# EAGLE design avrLCD (EAGLE 6.1)
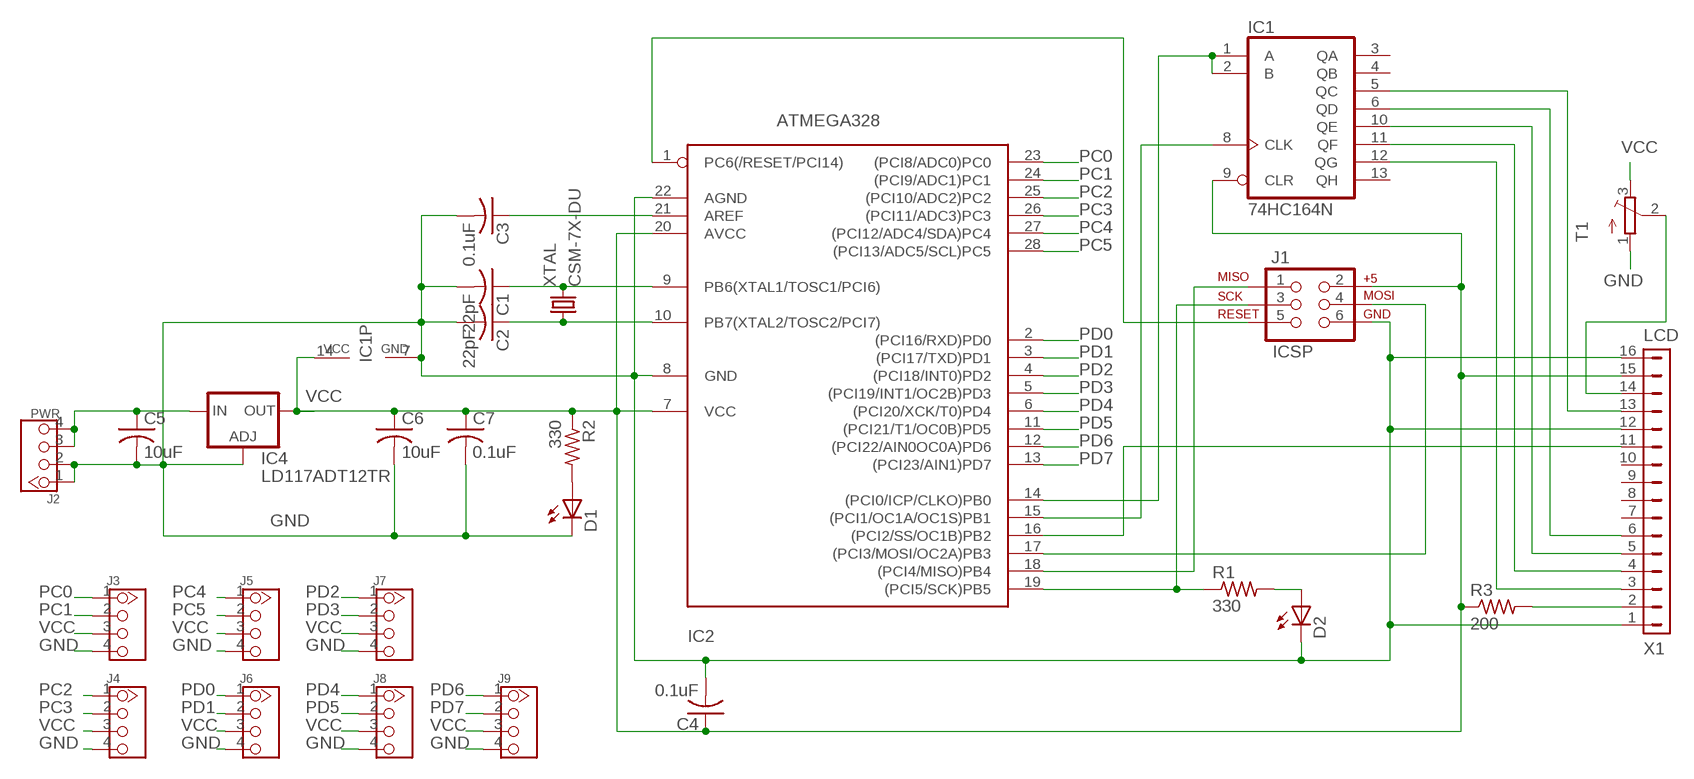
[diagram p0: schematic, sheet 1]

## Parts
C1  22pF  C-USC0805  [C0805]
C2  22pF  C-USC0805  [C0805]
C3  0.1uF  C-USC0805  [C0805]
C4  0.1uF  C-USC0805  [C0805]
C5  10uF  C-USC1206  [C1206]
C6  10uF  C-USC1206  [C1206]
C7  0.1uF  C-USC0805  [C0805]
D1  LEDCHIP-LED0805  [CHIP-LED0805]
D2  LEDCHIP-LED0805  [CHIP-LED0805]
IC1  74HC164N  [DIL14]
IC2  ATMEGA328  ATMEGA168-20P  [DIL28-3]
IC4  LD117ADT12TR  [DPACK]
J1  ICSP  AVR_SPI_PRG_6NS  [2X3-NS]
J2  PWR  TWIG-4P-2.0-2.0  [4P-2.0]
J3  TWIG-4P-2.0-2.0  [4P-2.0]
J4  TWIG-4P-2.0-2.0  [4P-2.0]
J5  TWIG-4P-2.0-2.0  [4P-2.0]
J6  TWIG-4P-2.0-2.0  [4P-2.0]
J7  TWIG-4P-2.0-2.0  [4P-2.0]
J8  TWIG-4P-2.0-2.0  [4P-2.0]
J9  TWIG-4P-2.0-2.0  [4P-2.0]
R1  330  R-US_R0805  [R0805]
R2  330  R-US_R0805  [R0805]
R3  200  R-US_R1206  [R1206]
T1  TRIMPOTTC33X  [TC33X]
X1  LCD  FH21-16S-1DS  [FH21-16S-1DS]
XTAL  CSM-7X-DU  [CSM-7X-DU]

## Nets
GND: C1.2 C2.2 C3.2 C4.2 C5.2 C6.2 C7.2 D1.C D2.C IC1.7(GND) IC2.8(GND) IC2.22(AGND) IC4.1(ADJ) J1.6 J2.1 J2.2 J3.4 J4.4 J5.4 J6.4 J7.4 J8.4 J9.4 T1.1(A) X1.1 X1.12 X1.16
N$1: IC2.17((PCI3/MOSI/OC2A)PB3) J1.4
N$2: IC2.18((PCI4/MISO)PB4) J1.1
N$3: IC2.19((PCI5/SCK)PB5) J1.3 R1.1
N$4: IC2.1(PC6(/RESET/PCI14)) J1.5
N$5: R3.2 X1.2
N$7: C1.1 IC2.9(PB6(XTAL1/TOSC1/PCI6)) XTAL.2
N$8: C2.1 IC2.10(PB7(XTAL2/TOSC2/PCI7)) XTAL.1
N$9: C3.1 IC2.21(AREF)
N$10: D2.A R1.2
N$11: IC1.1(A) IC1.2(B) IC2.14((PCI0/ICP/CLKO)PB0)
N$12: C5.1 IC4.3(IN) J2.3 J2.4
N$13: D1.A R2.2
N$14: IC1.8(CLK) IC2.15((PCI1/OC1A/OC1S)PB1)
N$15: IC1.5(QC) X1.13
N$16: IC2.16((PCI2/SS/OC1B)PB2) X1.11
N$17: IC1.6(QD) X1.6
N$18: IC1.10(QE) X1.5
N$19: IC1.11(QF) X1.4
N$20: IC1.12(QG) X1.3
N$22: T1.2(S) X1.14
PC0: IC2.23((PCI8/ADC0)PC0) J3.1
PC1: IC2.24((PCI9/ADC1)PC1) J3.2
PC2: IC2.25((PCI10/ADC2)PC2) J4.1
PC3: IC2.26((PCI11/ADC3)PC3) J4.2
PC4: IC2.27((PCI12/ADC4/SDA)PC4) J5.1
PC5: IC2.28((PCI13/ADC5/SCL)PC5) J5.2
PD0: IC2.2((PCI16/RXD)PD0) J6.1
PD1: IC2.3((PCI17/TXD)PD1) J6.2
PD2: IC2.4((PCI18/INT0)PD2) J7.1
PD3: IC2.5((PCI19/INT1/OC2B)PD3) J7.2
PD4: IC2.6((PCI20/XCK/T0)PD4) J8.1
PD5: IC2.11((PCI21/T1/OC0B)PD5) J8.2
PD6: IC2.12((PCI22/AIN0OC0A)PD6) J9.1
PD7: IC2.13((PCI23/AIN1)PD7) J9.2
VCC: C4.1 C6.1 C7.1 IC1.9(CLR) IC1.14(VCC) IC2.7(VCC) IC2.20(AVCC) IC4.4(OUT) J1.2 J3.3 J4.3 J5.3 J6.3 J7.3 J8.3 J9.3 R2.1 R3.1 T1.3(E) X1.15
Unconnected: IC1.3(QA) IC1.4(QB) IC1.13(QH) X1.7 X1.8 X1.9 X1.10

## Library data of the parts
C1-C7 = resistor:C-US: CAPACITOR, American symbol
D1 D2 = led:LED: LED OSRAM: - CHIPLED LG R971, LG N971, LY N971, LG Q971, LY Q971, LO R971, LY R971 LH N974, LH R974 LS Q976, LO Q976, LY Q976 LO Q996 - Hyper CHIPLED LW Q18S LB Q993, LB Q99A, LB R99A - SideLED LS A670, LO A670, LY A670, LG A670, LP A670 LB A673, LV A673, LT A673, LW A673 LH A674 LY A675 LS A676, LA A676, LO A676, LY A676, LW A676 LS A679, LY A679, LG A679 - Hyper Micro SIDELED® LS Y876, LA Y876, LO Y876, LY Y876 LT Y87S - SmartLED LW L88C, LW L88S LB L89C, LB L89S, LG L890 LS L89K, LO L89K, LY L89K LS L896, LA L896, LO L896, LY L896 - TOPLED LS T670, LO T670, LY T670, LG T670, LP T670 LSG T670, LSP T670, LSY T670, LOP T670, LYG T670 LG T671, LOG T671, LSG T671 LB T673, LV T673, LT T673, LW T673 LH T674 LS T676, LA T676, LO T676, LY T676, LB T676, LH T676, LSB T676, LW T676 LB T67C, LV T67C, LT T67C, LS T67K, LO T67K, LY T67K, LW E67C LS E67B, LA E67B, LO E67B, LY E67B, LB E67C, LV E67C, LT E67C LW T67C LS T679, LY T679, LG T679 LS T770, LO T770, LY T770, LG T770, LP T770 LB T773, LV T773, LT T773, LW T773 LH T774 LS E675, LA E675, LY E675, LS T675 LS T776, LA T776, LO T776, LY T776, LB T776 LHGB T686 LT T68C, LB T68C - Hyper Mini TOPLED® LB M676 - Mini TOPLED Santana® LG M470 LS M47K, LO M47K, LY M47K Source: http://www.osram.convergy.de LUXEON: - LUMILED® LXK2-PW12-R00, LXK2-PW12-S00, LXK2-PW14-U00, LXK2-PW14-V00 LXK2-PM12-R00, LXK2-PM12-S00, LXK2-PM14-U00 LXK2-PE12-Q00, LXK2-PE12-R00, LXK2-PE12-S00, LXK2-PE14-T00, LXK2-PE14-U00 LXK2-PB12-K00, LXK2-PB12-L00, LXK2-PB12-M00, LXK2-PB14-N00, LXK2-PB14-P00, LXK2-PB14-Q00 LXK2-PR12-L00, LXK2-PR12-M00, LXK2-PR14-Q00, LXK2-PR14-R00 LXK2-PD12-Q00, LXK2-PD12-R00, LXK2-PD12-S00 LXK2-PH12-R00, LXK2-PH12-S00 LXK2-PL12-P00, LXK2-PL12-Q00, LXK2-PL12-R00 Source: www.luxeon.com KINGBRIGHT: KA-3528ASYC Source: www.kingbright.com
IC1 = 74xx-eu:74*164: 8-bit parallel out SHIFT REGISTER
IC2 = adafruit:ATMEGA168*P: MICROCONTROLLER 16 kBytes FLASH 1 kBytes SRAM 512 Bytes EEPROM USART 8-channel 10 bit ADC
IC4 = v-reg:LD117A?*: Low drop fixed and adjustable positive voltage regulators 1 A Source: http://www.st.com/stonline/products/literature/ds/7194/ld1117axx.pdf
J1 = SparkFun:AVR_SPI_PRG_6: AVR ISP 6 Pin This is the reduced ISP connector for AVR programming. Common on Arduino. This footprint will take up less PCB space and can be used with a 10-pin to 6-pin adapter such as SKU: BOB-08508
J2-J9 = Connector:TWIG-4P-2.0
R1-R3 = resistor:R-US_: RESISTOR, American symbol
T1 = adafruit:TRIMPOT: SMT trimmer potentiometer part number TC33X http://www.ladyada.net/library/eagle
X1 = con-hirose:FH21-16S-1DS: FPC CONNECTOR Source: con-hirose.lbr from Bob Starr <rtzaudio@mindspring.com>; OC_FARNELL: unknown; OC_NEWARK: unknown
XTAL = crystal:CSM-7X-DU: SMD CRYSTAL Source: www.ecsxtal.com .. Crystal 3.6864MHz CSM_7X_DU.PDF; OC_FARNELL: unknown; OC_NEWARK: unknown

## Board
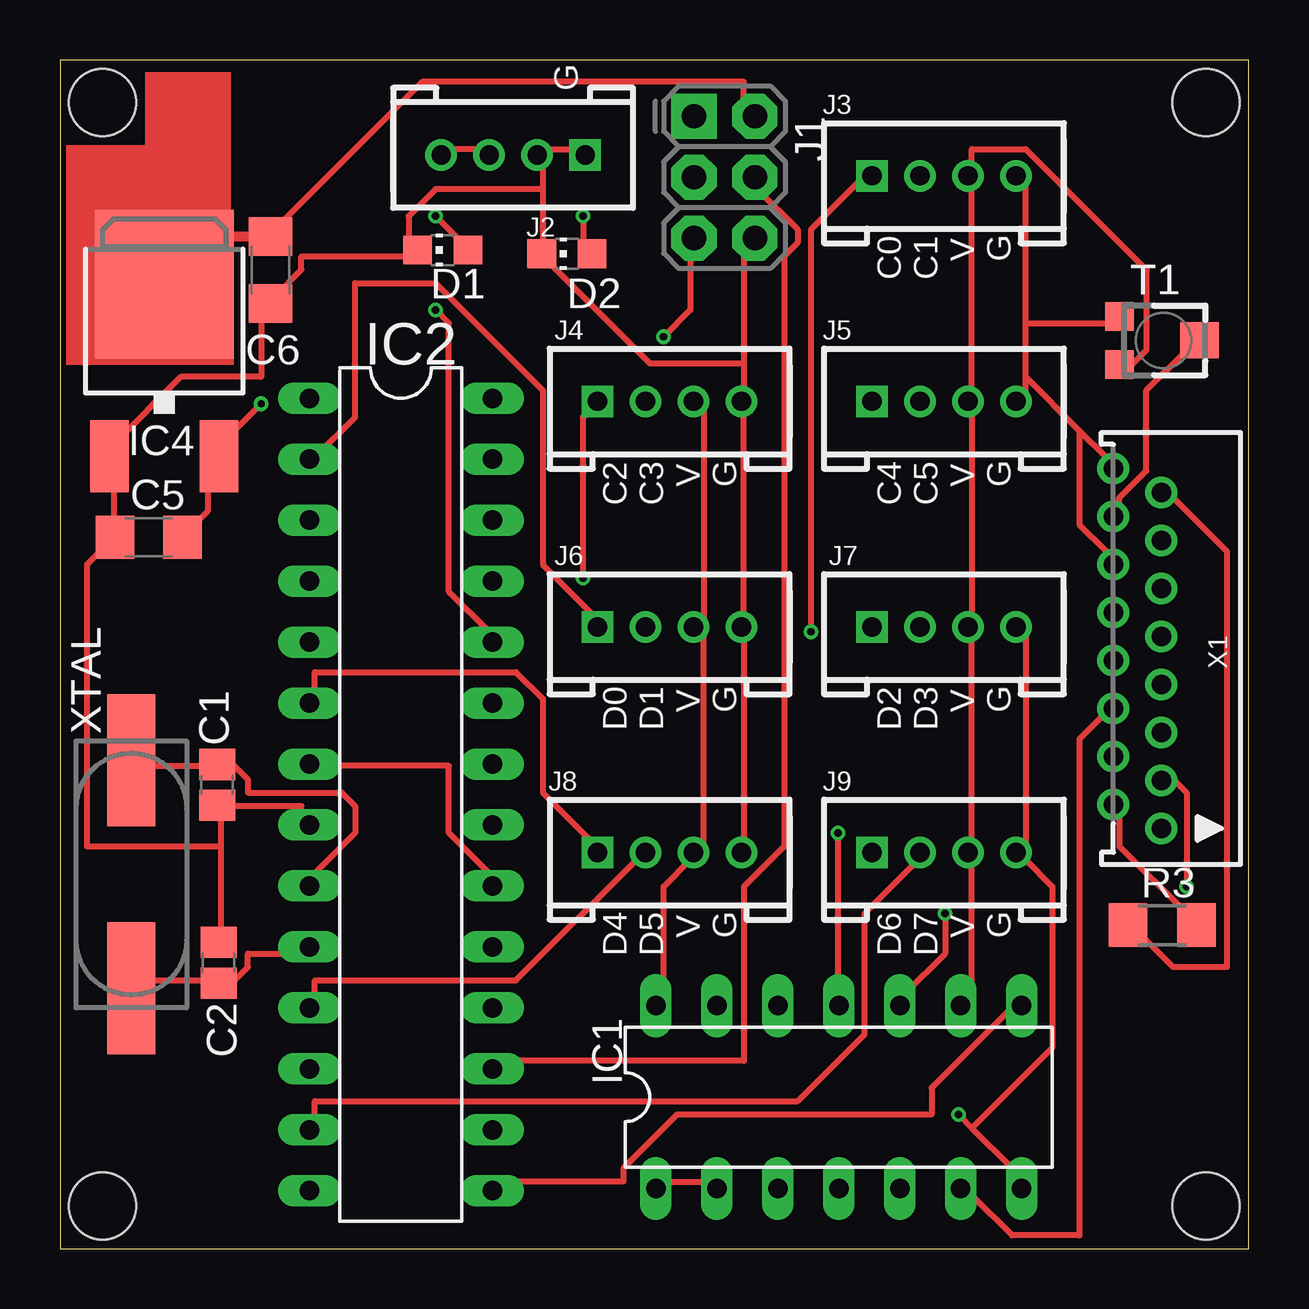
[diagram p1: board, top side]
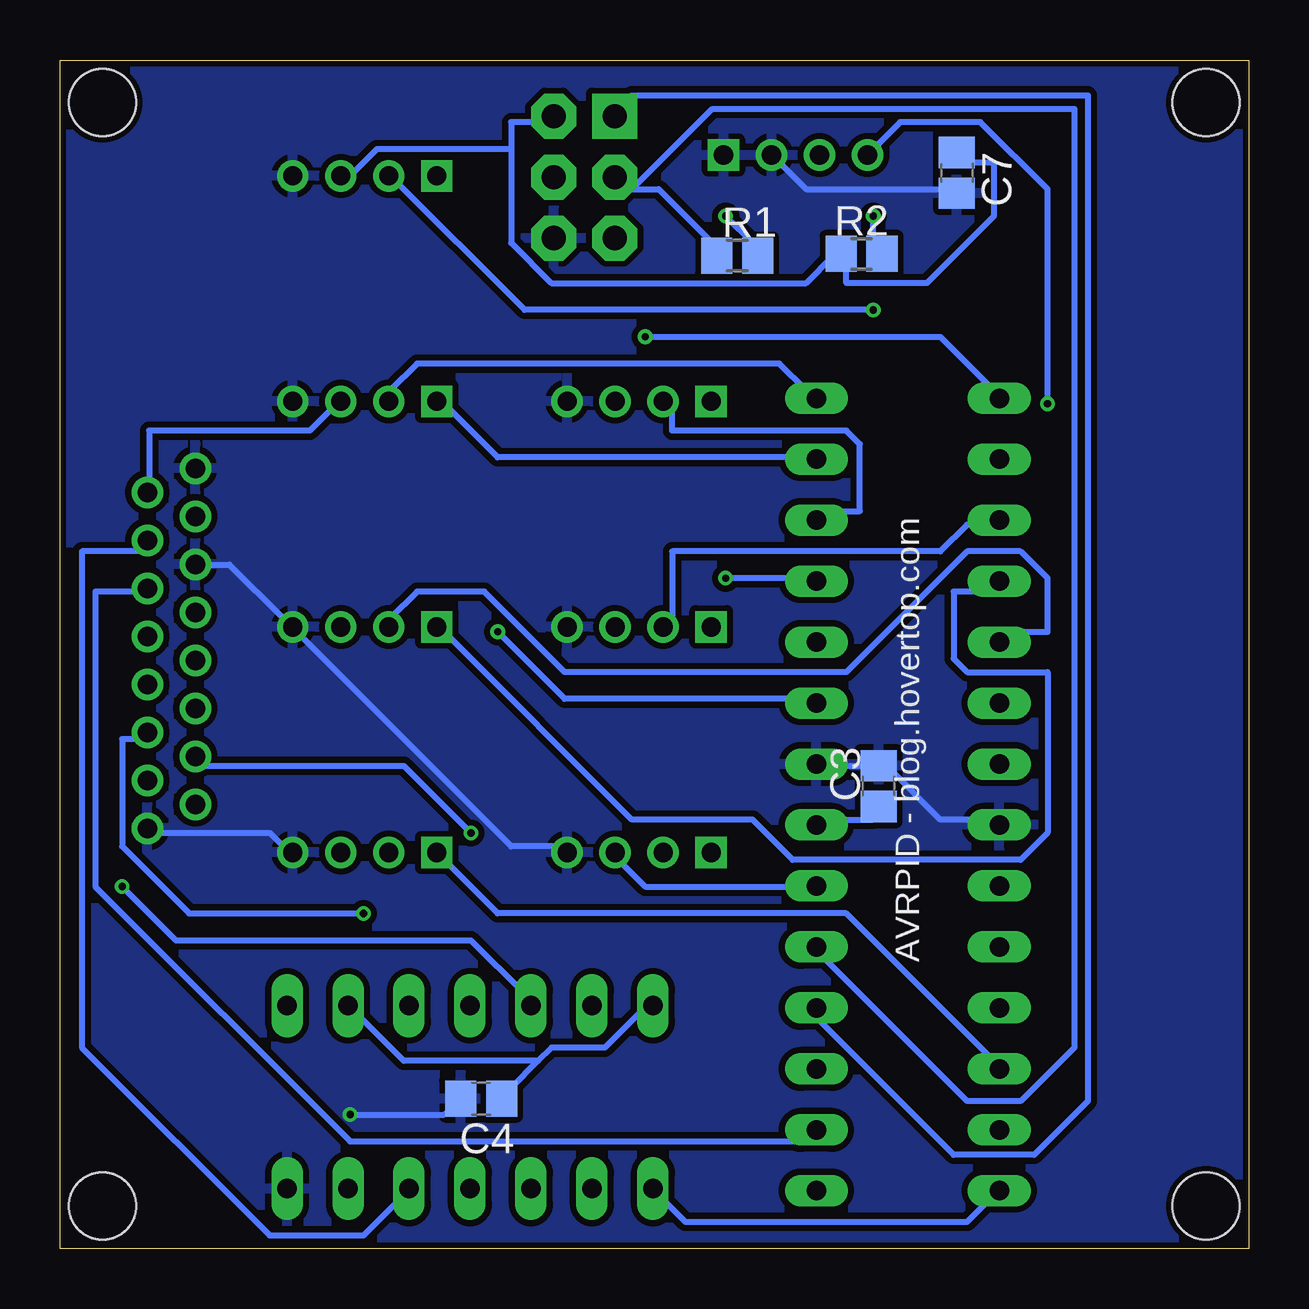
[diagram p2: board, bottom side, seen from below]

Size 49.53 x 49.53 mm. Coordinates in mm from the lower left corner, seen from the top.
Outline: 0,0 49.53,0 49.53,49.53 0,49.53 0,0
Copper layers (1*16): Top 0.035mm / dielectric 1.5mm / Bottom 0.035mm
Design rules: minimum track width 10mil, minimum drill 12mil, track to track 10mil, track to pad 10mil, pad to pad 10mil, via to via 10mil, smd to smd 0mil, copper to edge 10mil, drill to drill 10mil, minimum pad ring 10mil, minimum via ring 6mil, stop-mask expansion 2mil, vias tented up to drill 100mil, thermal gap 10mil
Holes 2.8 mm at 47.75,1.78 47.75,47.75 1.78,1.78 1.78,47.75

### Footprints (pad centres in the part's own frame; a part is rotated, then mirrored left to right if it is on the bottom)
C0805 = smd 1.3 x 1.5: 1 -0.85,0; 2 0.85,0
C1206 = smd 1.6 x 1.8: 1 -1.4,0; 2 1.4,0
CHIP-LED0805 = smd 1.2 x 1.2: A 0,-1.05; C 0,1.05
DIL14 = drill 0.813 long: 1 -7.62,-3.81; 2 -5.08,-3.81; 3 -2.54,-3.81; 4 0,-3.81; 5 2.54,-3.81; 6 5.08,-3.81; 7 7.62,-3.81; 8 7.62,3.81; 9 5.08,3.81; 10 2.54,3.81; 11 0,3.81; 12 -2.54,3.81; 13 -5.08,3.81; 14 -7.62,3.81
DIL28-3 = drill 0.813 long: 1 -16.51,-3.81; 2 -13.97,-3.81; 3 -11.43,-3.81; 4 -8.89,-3.81; 5 -6.35,-3.81; 6 -3.81,-3.81; 7 -1.27,-3.81; 8 1.27,-3.81; 9 3.81,-3.81; 10 6.35,-3.81; 11 8.89,-3.81; 12 11.43,-3.81; 13 13.97,-3.81; 14 16.51,-3.81; 15 16.51,3.81; 16 13.97,3.81; 17 11.43,3.81; 18 8.89,3.81; 19 6.35,3.81; 20 3.81,3.81; 21 1.27,3.81; 22 -1.27,3.81; 23 -3.81,3.81; 24 -6.35,3.81; 25 -8.89,3.81; 26 -11.43,3.81; 27 -13.97,3.81; 28 -16.51,3.81
DPACK = smd 1.6 x 3: 1 -2.28,-4.8; 3 2.28,-4.8 | smd 5.8 x 6.2: 4 0,2.38
2X3-NS = drill 1.016 pad 1.88 square: 1 -2.54,-1.27 | drill 1.016 pad 1.88 octagon: 2 -2.54,1.27; 3 0,-1.27; 4 0,1.27; 5 2.54,-1.27; 6 2.54,1.27
4P-2.0 = drill 0.8 pad 1.27 square: 1 -3,0 | drill 0.8 pad 1.27: 2 -1,0; 3 1,0; 4 3,0
R0805 = smd 1.3 x 1.5: 1 -0.85,0; 2 0.85,0
R1206 = smd 1.6 x 1.803: 1 -1.422,0; 2 1.422,0
TC33X = smd 1.2 x 1.2: 1 -1,-1.825; 3 1,-1.825 | smd 1.5 x 1.6: 2 0,1.5
FH21-16S-1DS = drill 0.813: 1 -7.5,0; 2 -6.5,2; 3 -5.5,0; 4 -4.5,2; 5 -3.5,0; 6 -2.5,2; 7 -1.5,0; 8 -0.5,2; 9 0.5,0; 10 1.5,2; 11 2.5,0; 12 3.5,2; 13 4.5,0; 14 5.5,2; 15 6.5,0; 16 7.5,2
CSM-7X-DU = smd 5.5 x 2: 1 -4.75,0; 2 4.75,0

### Placement (x,y rotation side)
C1  6.54,19.33 270 top
C2  6.61,11.91 90 top
C3  15.42,19.28 90 bottom
C4  31.98,6.25 180 bottom
C5  3.7,29.65 180 top
C6  8.77,40.78 270 top
C7  12.16,44.83 270 bottom
D1  15.95,41.61 90 top
D2  21.12,41.46 90 top
IC1  32.45,6.31 0 top
IC2  14.2,18.93 270 top
IC4  4.35,37.81 0 top
J1  27.69,44.65 270 top
J2  18.88,45.57 180 top
J3  36.83,44.7 0 top
J4  25.4,35.31 0 top
J5  36.83,35.31 0 top
J6  25.4,25.91 0 top
J7  36.83,25.91 0 top
J8  25.4,16.51 0 top
J9  36.83,16.51 0 top
R1  21.31,41.38 0 bottom
R2  16.13,41.45 0 bottom
R3  45.93,13.48 0 top
T1  45.97,37.85 270 top
X1  45.89,25.01 90 top
XTAL  2.98,15.61 90 top

### Tracks (layer width: path | path; a pad name or v marks a point on that pad's centre or on a via)
GND  (via drill 0.3)
  Top 0.254: 38,5.03 39.67,3.35 39.67,2.79 IC1.7 40.23,2.79 | 38,5.03 v37.44,5.59 | 40.23,38.56 44.15,38.56 T1.1 | 40.23,36.32 40.23,35.76 J5.4 | 40.23,36.32 40.23,38.56 | 40.23,38.56 40.23,44.7 J3.4 | 40.23,36.32 42.47,34.09 | 42.47,34.09 43.59,32.97 X1.16 | 42.47,34.09 42.47,30.18 43.59,29.06 X1.12 | J7.4 40.23,25.7 40.23,16.76 J9.4 40.23,16.2 41.35,15.09 41.35,8.38 38,5.03 | 6.71,18.44 10.06,18.44 10.06,17.88 IC2.8 | 6.71,18.44 6.71,16.76 | 6.71,16.76 6.71,12.85 C2.2 | 6.71,18.44 C1.2 | 6.71,16.76 1.12,16.76 1.12,28.5 2.23,29.62 C5.2 2.23,30.18 2.23,32.97 IC4.1 2.23,33.53 5.03,36.32 8.38,36.32 8.38,39.12 C6.2 8.94,39.67 10.06,40.79 10.06,41.35 14.53,41.35 D1.C 14.53,41.91 14.53,43.03 15.65,44.15 20.12,44.15 | 20.12,44.15 20.12,45.26 J2.2 20.12,45.82 21.79,45.82 J2.1 | 20.12,44.15 20.12,41.91 D2.C 20.12,41.35 24.59,36.88 28.5,36.88 | 28.5,36.88 28.5,41.91 J1.6 | 28.5,36.88 28.5,35.76 J4.4 28.5,35.2 28.5,26.26 J6.4 28.5,25.7 28.5,16.76 J8.4
  Bottom 0.254: v37.44,5.59 33.53,5.59 32.97,6.15 C4.2 | J9.4 40.23,16.76 40.79,17.32 45.82,17.32 X1.1 | X1.12 43.59,28.5 42.47,28.5 40.23,26.26 J7.4 39.67,25.7 30.73,16.76 28.5,16.76 J8.4 | IC2.22 17.88,20.12 15.65,20.12 C3.2 15.09,20.12 12.85,17.88 10.62,17.88 IC2.8 | C7.2 12.29,44.15 18.44,44.15 19.56,45.26 J2.2
  pour Bottom: 0.25,49.28 49.28,49.28 49.28,0.25 0.25,0.25
N$1
  Top 0.254: IC2.17 18.44,7.82 28.5,7.82 28.5,15.09 30.18,16.76 30.18,41.35 30.73,41.91 30.73,42.47 29.06,44.15 J1.4
N$2
  Bottom 0.254: IC2.18 17.88,9.5 12.29,3.91 8.94,3.91 6.71,6.15 6.71,48.06 25.7,48.06 26.26,47.5 J1.1
N$3
  Bottom 0.254: 25.7,44.15 26.26,44.15 J1.3 25.7,44.15 | 25.7,44.15 24.59,44.15 22.35,41.91 R1.1 | 25.7,44.15 22.35,47.5 7.26,47.5 7.26,8.38 9.5,6.15 11.73,6.15 17.88,12.29 IC2.19
N$4  (via drill 0.3)
  Top 0.254: v25.15,38 26.26,39.12 26.26,41.91 J1.5
  Bottom 0.254: v25.15,38 12.85,38 10.62,35.76 IC2.1
N$5
  Top 0.254: R3.2 46.94,13.97 44.15,16.76 44.15,18.44 X1.2
N$7
  Top 0.254: XTAL.2 3.35,20.12 6.15,20.12 C1.1 6.71,20.68 7.82,19.56 7.82,19 11.73,19 12.29,18.44 12.29,17.32 10.62,15.65 IC2.9
N$8
  Top 0.254: XTAL.1 3.35,11.18 6.15,11.18 C2.1 6.71,10.62 7.82,11.73 7.82,12.29 10.06,12.29 IC2.10
N$9
  Bottom 0.254: C3.1 15.65,17.88 17.88,17.88 IC2.21
N$10  (via drill 0.3)
  Top 0.254: v21.79,43.03 21.79,41.91 D2.A
  Bottom 0.254: v21.79,43.03 20.68,41.91 R1.2
N$11
  Top 0.254: IC1.2 26.82,2.79 25.15,2.79 IC1.1
  Bottom 0.254: IC2.14 10.62,2.23 11.73,1.12 23.47,1.12 24.59,2.23 IC1.1
N$12  (via drill 0.3)
  Top 0.254: J2.4 16.2,45.82 17.88,45.82 J2.3 | C5.1 5.59,30.18 6.15,30.73 6.15,32.97 IC4.3 6.71,33.53 v8.38,35.2
  Bottom 0.254: v8.38,35.2 8.38,44.15 11.18,46.94 14.53,46.94 15.65,45.82 J2.4
N$13  (via drill 0.3)
  Top 0.254: v15.65,43.03 16.76,41.91 D1.A
  Bottom 0.254: v15.65,43.03 15.65,41.91 R2.2
N$14
  Top 0.254: IC2.15 18.44,2.79 23.47,2.79 23.47,3.35 25.7,5.59 36.32,5.59 36.32,6.71 39.67,10.06 IC1.8
N$15
  Bottom 0.254: IC1.5 35.2,2.23 36.88,0.56 40.79,0.56 48.62,8.38 48.62,29.06 45.82,29.06 X1.13
N$16
  Bottom 0.254: IC2.16 18.44,4.47 37.44,4.47 48.06,15.09 48.06,27.38 46.38,27.38 X1.11
N$17
  Top 0.254: IC1.6 38,2.23 39.67,0.56 42.47,0.56 42.47,21.23 43.59,22.35 X1.6
N$18  (via drill 0.3)
  Top 0.254: v36.88,13.97 36.88,12.29 35.2,10.62 IC1.10
  Bottom 0.254: v36.88,13.97 44.15,13.97 46.94,16.76 46.94,21.23 46.38,21.23 X1.5
N$19  (via drill 0.3)
  Top 0.254: v32.41,17.32 32.41,10.62 IC1.11
  Bottom 0.254: v32.41,17.32 35.2,20.12 43.59,20.12 X1.4
N$20  (via drill 0.3)
  Top 0.254: v46.94,15.09 46.94,19 46.38,19.56 X1.3
  Bottom 0.254: v46.94,15.09 44.7,12.85 32.41,12.85 30.18,10.62 IC1.12
N$22
  Top 0.254: T1.2 46.94,37.44 45.26,35.76 45.26,32.41 44.15,31.29 44.15,30.73 X1.14
PC0  (via drill 0.3)
  Top 0.254: v31.29,25.7 31.29,42.47 33.53,44.7 J3.1
  Bottom 0.254: v31.29,25.7 28.5,22.91 18.44,22.91 IC2.23
PC1  (via drill 0.3)
  Top 0.254: v15.65,39.12 16.2,38.56 16.2,27.38 17.88,25.7 IC2.24
  Bottom 0.254: v15.65,39.12 30.18,39.12 35.76,44.7 J3.2
PC2  (via drill 0.3)
  Top 0.254: v21.79,27.94 21.79,34.65 22.35,35.2 J4.1
  Bottom 0.254: v21.79,27.94 18.44,27.94 IC2.25
PC3
  Bottom 0.254: J4.2 24.03,35.2 24.03,34.09 16.76,34.09 16.2,33.53 16.2,30.73 17.88,30.73 IC2.26
PC4
  Bottom 0.254: J5.1 33.53,35.2 31.29,32.97 18.44,32.97 IC2.27
PC5
  Bottom 0.254: J5.2 35.76,35.76 34.65,36.88 19.56,36.88 18.44,35.76 IC2.28
PD0
  Top 0.254: J6.1 22.35,26.26 20.12,28.5 20.12,35.76 15.65,40.23 12.29,40.23 12.29,34.65 10.62,32.97 IC2.2
PD1
  Bottom 0.254: J6.2 24.03,26.26 24.03,29.06 12.85,29.06 11.73,30.18 10.62,30.18 IC2.3
PD2
  Bottom 0.254: J7.1 33.53,25.7 25.7,17.88 20.68,17.88 19,16.2 9.5,16.2 8.38,17.32 8.38,24.03 11.73,24.03 12.29,24.59 12.29,27.38 10.62,27.38 IC2.4
PD3
  Bottom 0.254: J7.2 35.76,26.26 34.65,27.38 31.85,27.38 28.5,24.03 16.76,24.03 11.73,29.06 9.5,29.06 8.38,27.94 8.38,25.7 10.06,25.7 IC2.5
PD4
  Top 0.254: J8.1 22.35,16.76 20.12,19 20.12,22.91 19,24.03 10.62,24.03 10.62,22.91 IC2.6
PD5
  Top 0.254: J8.2 24.03,16.2 19,11.18 10.62,11.18 10.62,10.06 IC2.11
PD6
  Bottom 0.254: J9.1 33.53,16.2 31.29,13.97 16.76,13.97 10.62,7.82 IC2.12
PD7
  Top 0.254: J9.2 35.76,16.2 33.53,13.97 33.53,8.94 30.73,6.15 10.62,6.15 10.62,5.03 IC2.13
VCC
  Top 0.254: 38,44.7 38,45.82 40.23,45.82 45.26,40.79 45.26,37.44 44.7,36.88 T1.3 | C6.1 8.94,42.47 15.09,48.62 28.5,48.62 28.5,47.5 J1.2 | R3.1 44.7,13.41 46.38,11.73 48.62,11.73 48.62,29.06 46.38,31.29 X1.15 | J4.3 26.82,35.2 26.82,26.26 J6.3 26.82,25.7 26.82,16.76 J8.3 26.26,16.2 25.15,15.09 25.15,10.62 IC1.14 25.15,10.06 | IC1.9 38,10.62 38,16.2 J9.3 38,16.76 38,25.7 J7.3 38,26.26 38,35.2 J5.3 38,35.76 38,44.7 | IC2.7 10.62,20.12 16.2,20.12 16.2,17.32 17.88,15.65 IC2.20 | 38,44.7 J3.3
  Top 0.406: IC4.4 6.34,42.18 C6.1
  Bottom 0.254: C7.1 11.73,45.26 10.62,45.26 10.62,43.03 13.41,40.23 16.76,40.23 16.76,41.35 R2.1 17.32,41.35 18.44,40.23 29.06,40.23 30.73,41.91 30.73,45.82 | 30.73,45.82 30.73,46.94 29.06,46.94 J1.2 | 30.73,45.82 36.32,45.82 37.44,44.7 J3.3 | 29.62,7.82 29.06,8.38 26.82,8.38 25.15,10.06 IC1.14 | 29.62,7.82 30.73,6.71 C4.1 | IC2.20 18.44,15.09 25.15,15.09 26.26,16.2 J8.3 | 29.62,7.82 35.2,7.82 37.44,10.06 IC1.9 | X1.15 45.82,31.85 45.82,34.09 39.12,34.09 38,35.2 J5.3
(copper drawn outside any net)
  shapes: Top area x3

### Text on the board
tNames: G | V | G | C0 | C1 | V | G | V | G | C2 | C3 | C4 | C5 | D0 | D1 | V | G | D2 | D3 | V | G | V | G | V | G | D4 | D5 | D6 | D7
bNames: AVRPID - blog.hovertop.com